# Altium schematic sheet Sheet1.SchDoc
size A
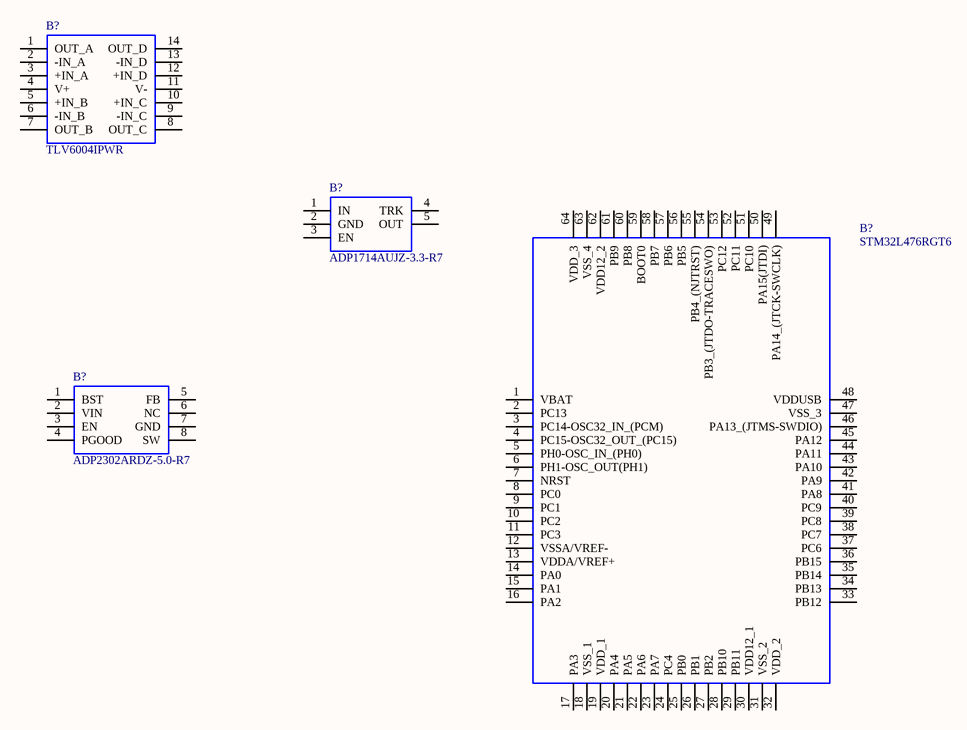
[diagram p0: Sheet1.SchDoc]

## Parts
(Parts that share a designator on the sheet are numbered #1, #2 ... from top to bottom, then left to right.)
B?#1  TLV6004IPWR  [SOP65P640X120-14N]
B?#2  ADP1714AUJZ-3.3-R7  [SOT95P280X100-5N]
B?#3  ADP2302ARDZ-5.0-R7  [SOIC127P600X175-9N]
B?#4  STM32L476RGT6  [QFP50P1200X1200X160-64N]

## Nets

Not connected (* = marked no-connect by the designer): B?#1 1(OUT_A) 2(-IN_A) 3(+IN_A) 4(V+) 5(+IN_B) 6(-IN_B) 7(OUT_B) 8(OUT_C) 9(-IN_C) 10(+IN_C) 11(V-) 12(+IN_D) 13(-IN_D) 14(OUT_D); B?#2 1(IN) 2(GND) 3(EN) 4(TRK) 5(OUT); B?#3 1(BST) 2(VIN) 3(EN) 4(PGOOD) 5(FB) 6(NC) 7(GND) 8(SW); B?#4 1(VBAT) 2(PC13) 3(PC14-OSC32_IN_(PCM)) 4(PC15-OSC32_OUT_(PC15)) 5(PH0-OSC_IN_(PH0)) 6(PH1-OSC_OUT(PH1)) 7(NRST) 8(PC0) 9(PC1) 10(PC2) 11(PC3) 12(VSSA/VREF-) 13(VDDA/VREF+) 14(PA0) 15(PA1) 16(PA2) 17(PA3) 18(VSS_1) 19(VDD_1) 20(PA4) 21(PA5) 22(PA6) 23(PA7) 24(PC4) 25(PB0) 26(PB1) 27(PB2) 28(PB10) 29(PB11) 30(VDD12_1) 31(VSS_2) 32(VDD_2) 33(PB12) 34(PB13) 35(PB14) 36(PB15) 37(PC6) 38(PC7) 39(PC8) 40(PC9) 41(PA8) 42(PA9) 43(PA10) 44(PA11) 45(PA12) 46(PA13_(JTMS-SWDIO)) 47(VSS_3) 48(VDDUSB) 49(PA14_(JTCK-SWCLK)) 50(PA15(JTDI)) 51(PC10) 52(PC11) 53(PC12) 54(PB3_(JTDO-TRACESWO)) 55(PB4_(NJTRST)) 56(PB5) 57(PB6) 58(PB7) 59(BOOT0) 60(PB8) 61(PB9) 62(VDD12_2) 63(VSS_4) 64(VDD_3)

## Library data of the parts
B?#1 = TLV6004IPWR: Operational Amplifiers - Op Amps 1-MHz, Low-Power Operational Amplifier for Cost-Sensitive Systems 14-TSSOP -40 to 125; Manufacturer_Name: Texas Instruments; Geometry.Height: 1.2mm; TI store Part Number: TLV6004IPWR; Manufacturer_Part_Number: TLV6004IPWR; Datasheet Link: http://www.ti.com/lit/gpn/tlv6004
B?#2 = ADP1714AUJZ-3.3-R7: 300 mA, Low Dropout CMOS Linear Regulator; Manufacturer_Name: Analog Devices; Manufacturer_Part_Number: ADP1714AUJZ-3.3-R7; RS Part Number: *; RS Price/Stock: *; Arrow Part Number: ADP1714AUJZ-3.3-R7; Arrow Price/Stock: *; Datasheet Link: *
B?#3 = ADP2302ARDZ-5.0-R7: Step-Down Regulators; Manufacturer_Name: Analog Devices; Manufacturer_Part_Number: ADP2302ARDZ-5.0-R7; RS Part Number: 7591815P; RS Price/Stock: http://uk.rs-online.com/web/p/products/7591815P; Arrow Part Number: ADP2302ARDZ-5.0-R7; Arrow Price/Stock: https://www.arrow.com/en/products/adp2302ardz-5.0-r7/analog-devices; Datasheet Link: *
B?#4 = STM32L476RGT6: ARM MCU 32-bit 80MHz 1024KB  LQFP64 STMicroelectronics STM32L476RGT6, 32bit ARM Cortex M4 MCU, 80MHz, 1 MB Flash, 64-Pin LQFP; Geometry.Height: 1.6mm; Manufacturer_Name: STMicroelectronics; Manufacturer_Part_Number: STM32L476RGT6; RS Part Number: 1658235; RS Price/Stock: http://uk.rs-online.com/web/p/products/1658235; Arrow Part Number: STM32L476RGT6; Arrow Price/Stock: https://www.arrow.com/en/products/stm32l476rgt6/stmicroelectronics; Datasheet Link: https://componentsearchengine.com/Datasheets/1/STM32L476RGT6.pdf